# EasyEDA Pro project 干电池充电器.eprj, board PCB4
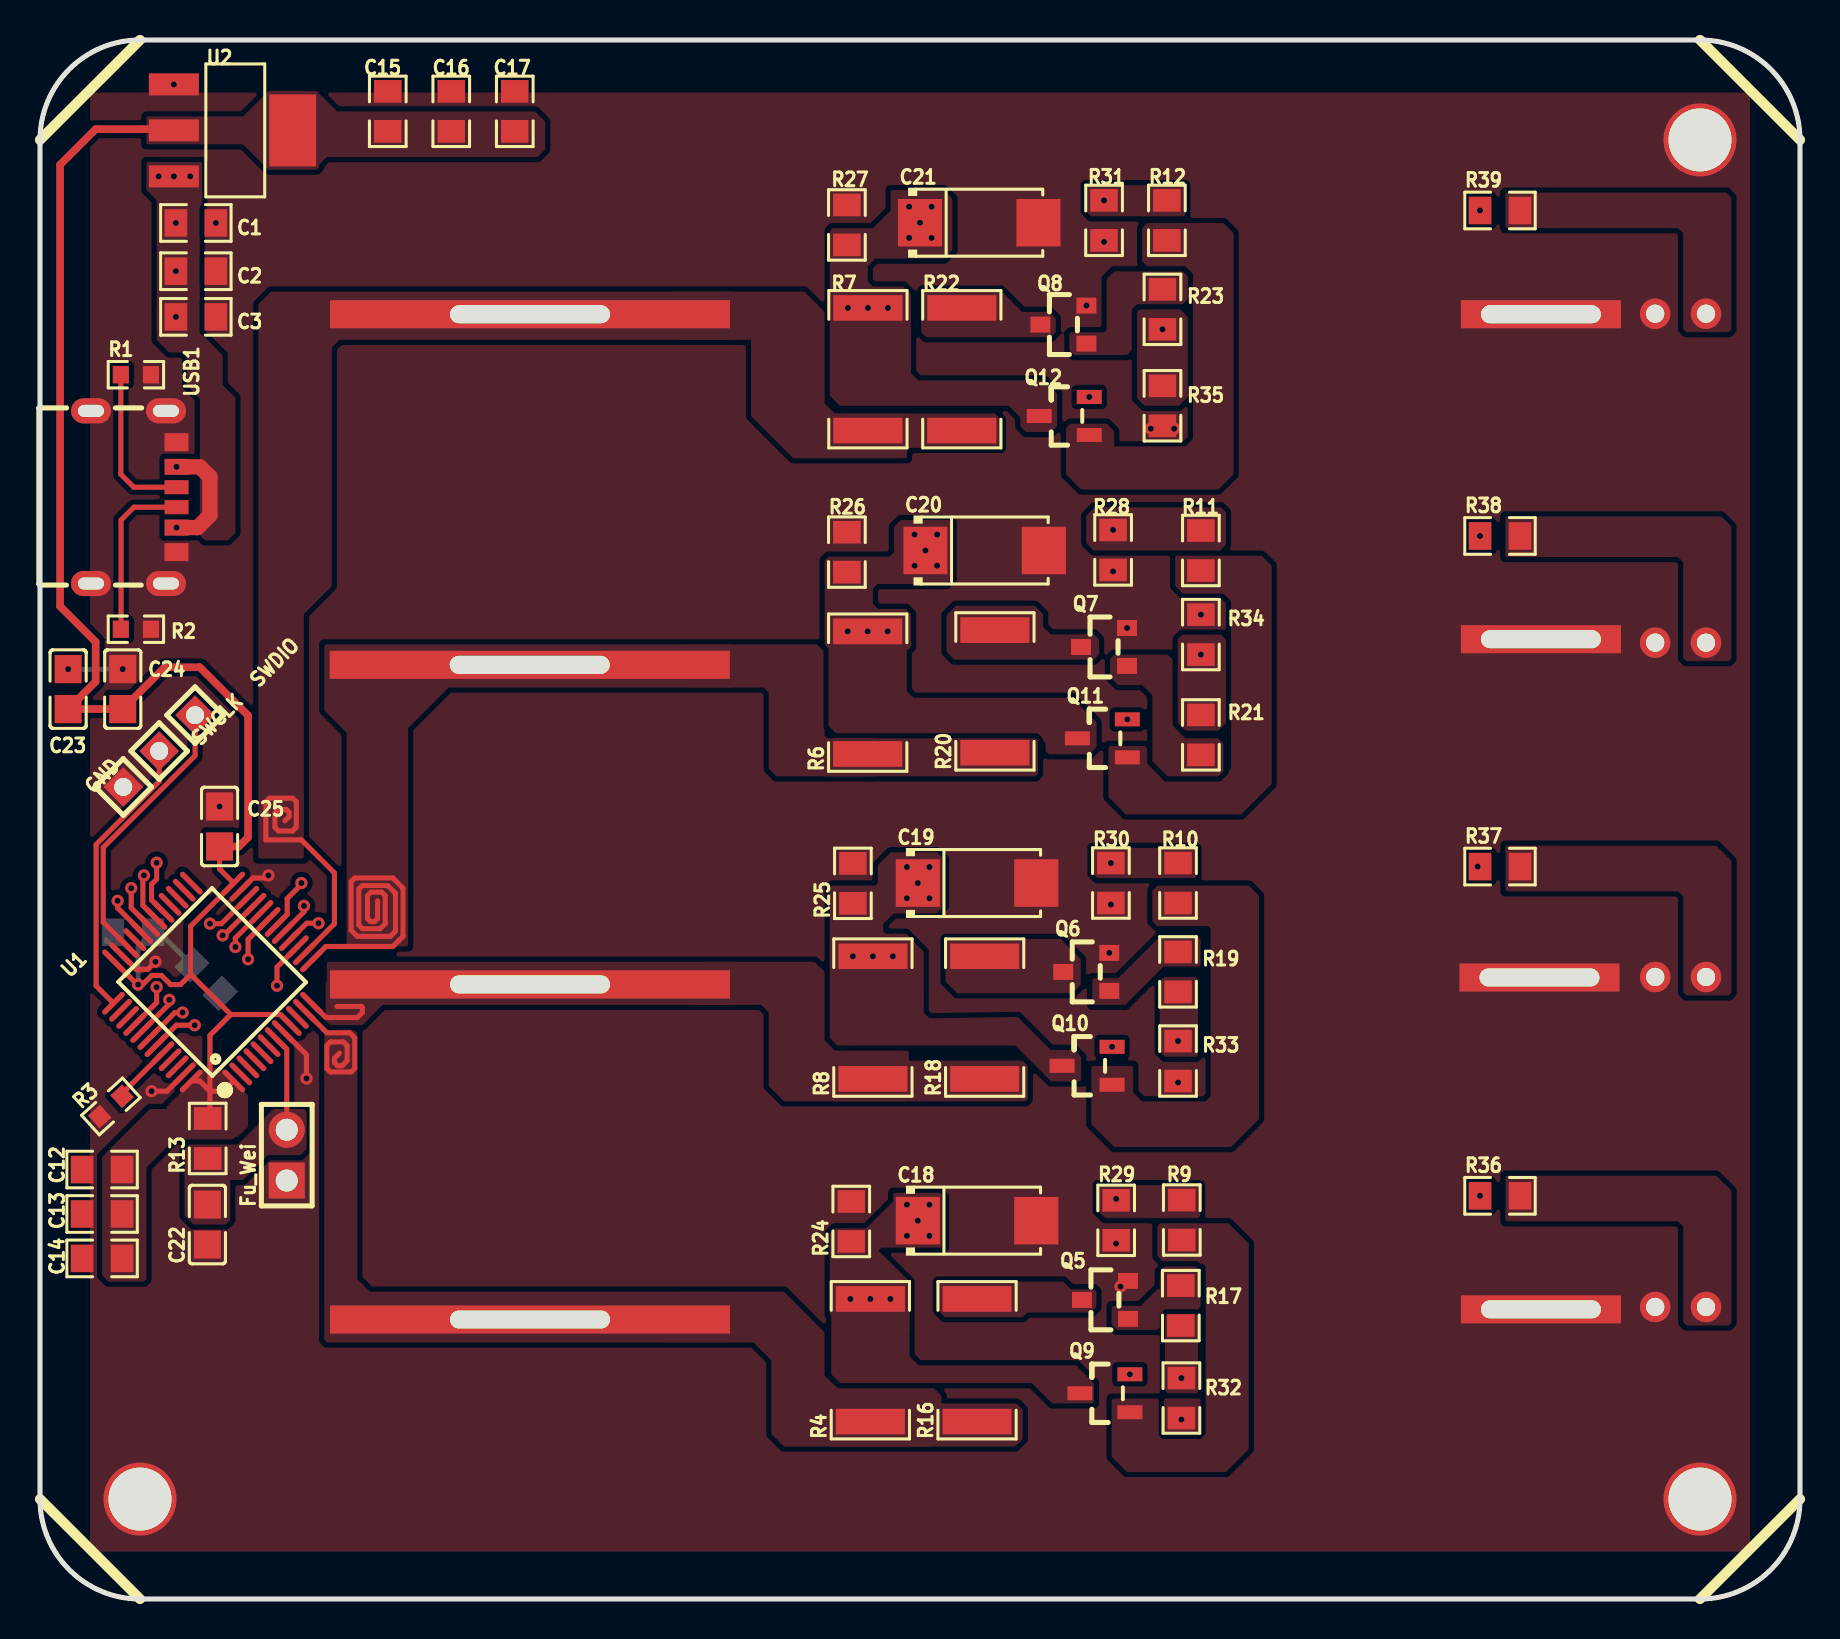
[diagram p3: board, top side]
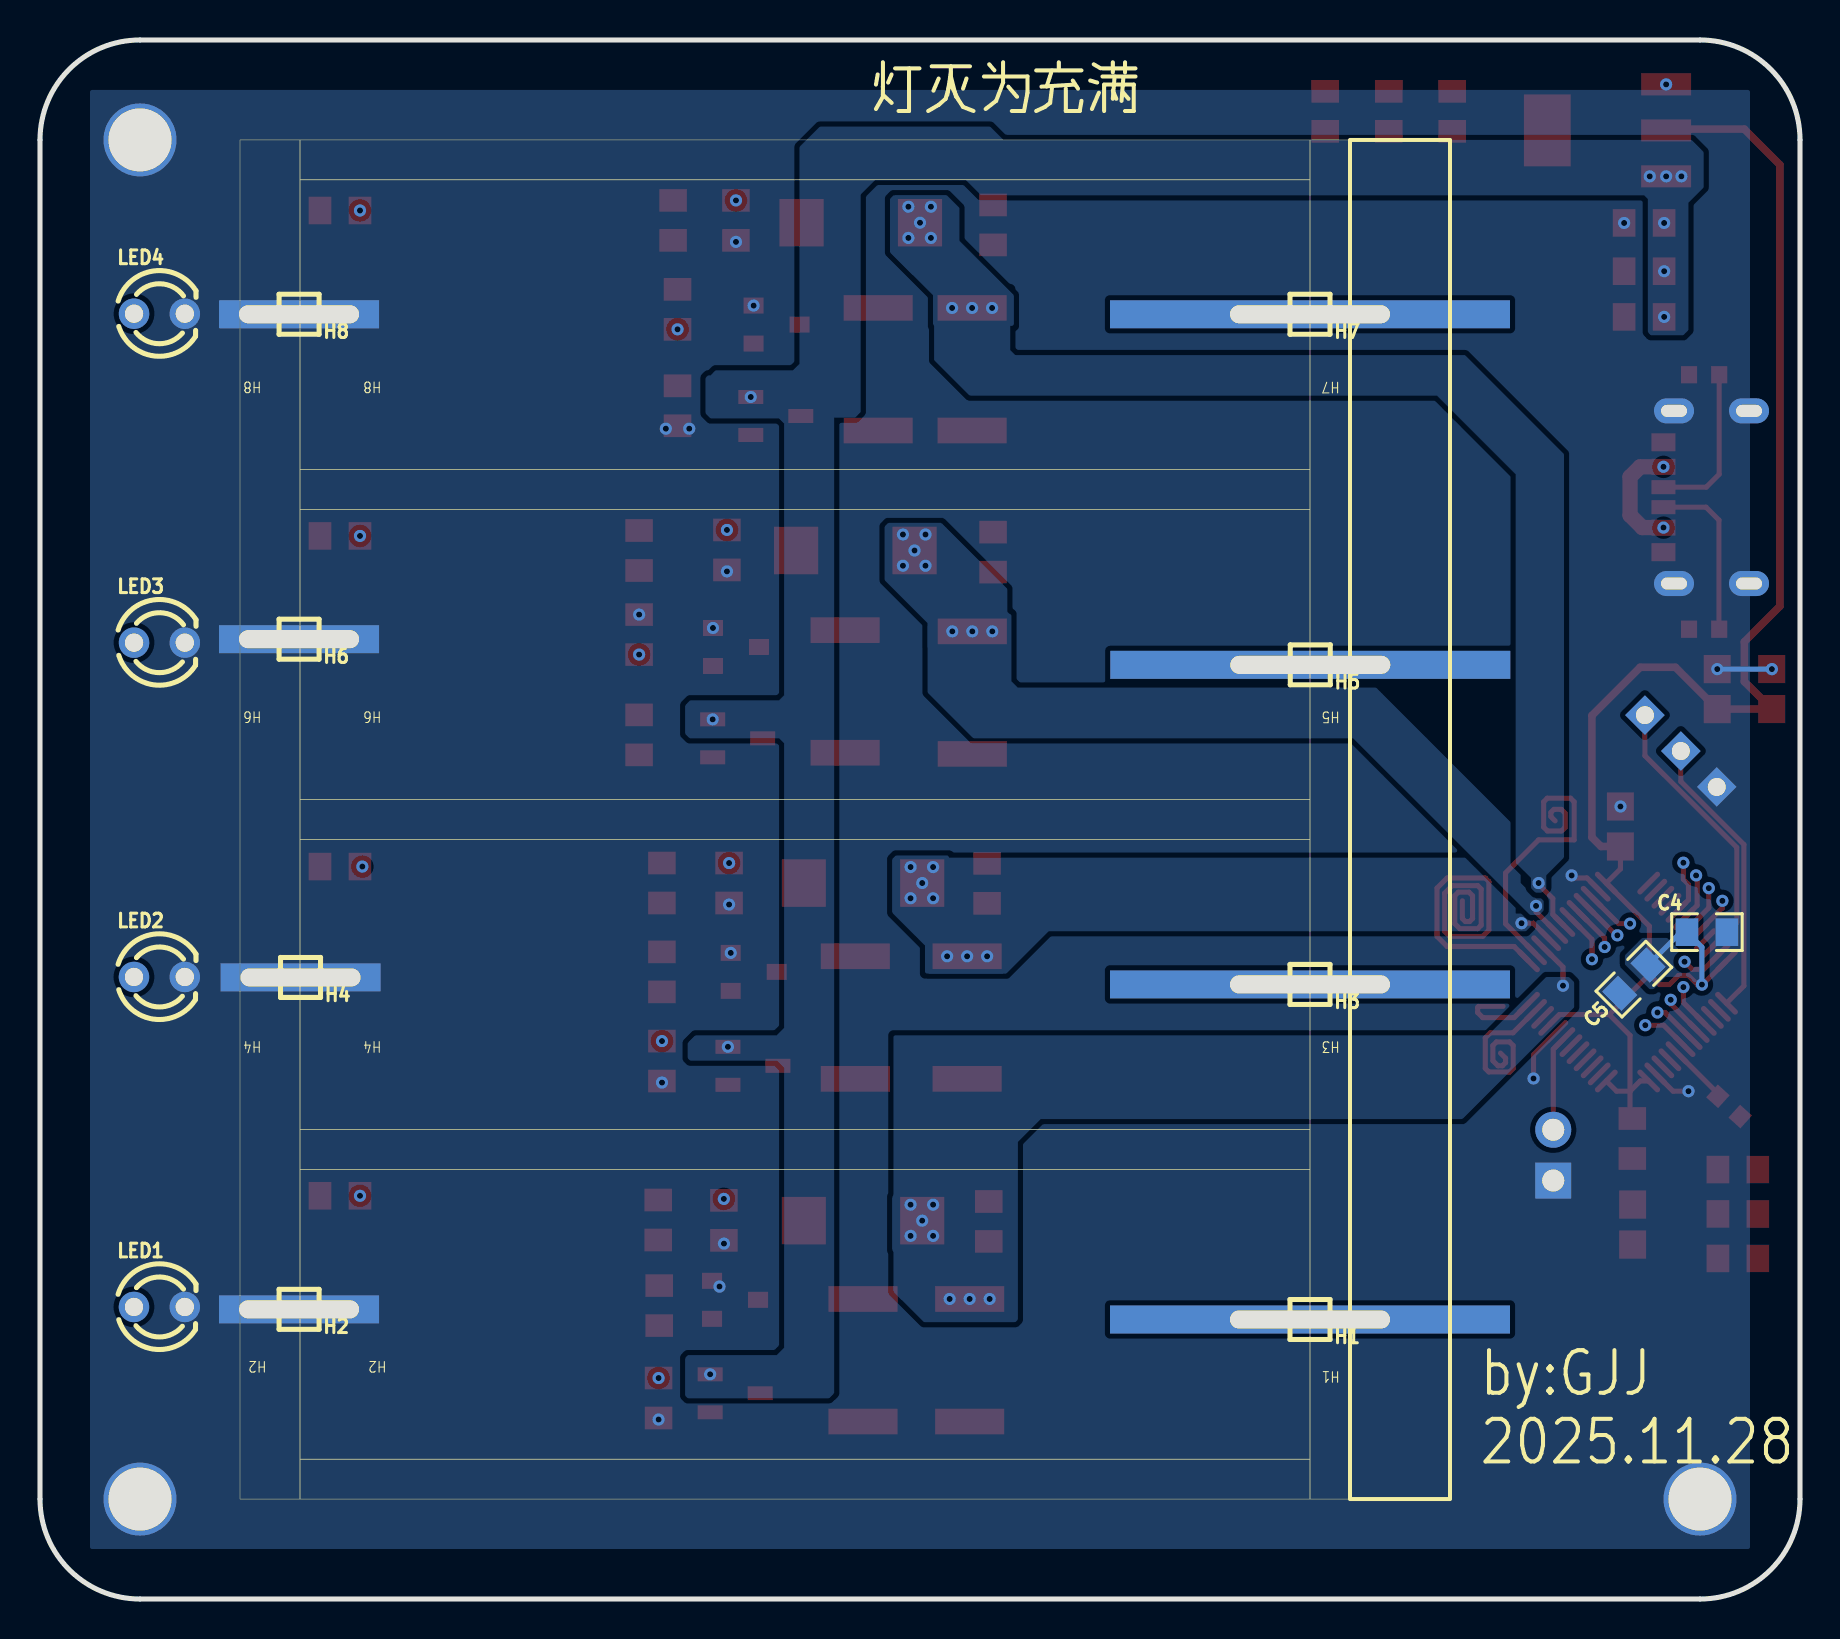
[diagram p4: board, bottom side, seen from below]

Outline 88 x 78 mm; copper layers: Top Layer, Inner1, Inner2, Bottom Layer. Coordinates in mm from the lower left corner of the outline.
Outline path: 0,73 0,5 arc(1.46,1.46) 5,0 83,0 arc(86.54,1.46) 88,5 88,73 arc(86.54,76.54) 83,78 5,78 arc(1.46,76.54) 0,73
Stack: Top Layer 0.035mm 外层铜厚1oz / Dielectric1 0.2104mm 7628 RC49% 8.6mil / Inner1 0.0152mm 内层铜厚 / Dielectric2 1.065mm 1.1mm H/HOZ Copper / Inner2 0.0152mm 内层铜厚 / Dielectric3 0.2104mm 7628 RC49% 8.6mil / Bottom Layer 0.035mm 外层铜厚1oz

## Design rules (mm)
template: 自定义配置
spacing copperThickness1oz (default): track to track 0.102, other pairs 0.152 to 0.3
spacing copperThickness2oz: track to track 0.203, other pairs 0.152 to 0.3
track width copperThickness1oz (default): min 0.127, default 0.254, max 2.54
track width copperThickness2oz: min 0.203, default 0.254, max 2.54
differential pair differentialPair (default): width min 0.127, default 0.254, max 2.54; gap min 0.152, default 0.152
via viaSize (default): diameter min 0.5, default 0.61, max 10; hole min 0.3, default 0.305, max 6.3

## Placement (name value [footprint] x y rotation side)
C1  10uf  [D0805]  7.79 68.84 180 top
C2  1uf  [D0805]  7.79 66.43 180 top
C3  0.1uf  [D0805]  7.79 64.15 180 top
C4  1uf  [D0805]  4.65 33.36 0 bottom
C5  0.1uf  [D0805]  8.3 31.01 135 bottom
C12  10uf  [D0805]  3.11 21.49 180 top
C13  1uf  [D0805]  3.11 19.26 180 top
C14  0.1uf  [D0805]  3.11 17.04 180 top
C15  10uf  [D0805]  17.39 74.43 90 top
C16  1uf  [D0805]  20.56 74.43 90 top
C17  0.1uf  [D0805]  23.74 74.43 90 top
C18  220uF  [CAP-SMD_L6.0-W3.2]  46.85 18.93 0 top
C19  220uF  [CAP-SMD_L6.0-W3.2]  46.85 35.82 0 top
C20  220uF  [CAP-SMD_L6.0-W3.2]  47.23 52.46 0 top
C21  220uF  [CAP-SMD_L6.0-W3.2]  46.96 68.86 0 top
C22  1uf  [C0805]  8.37 18.74 90 top
C23  100nF  [C0805]  1.41 45.52 90 top
C24  1000nF  [C0805]  4.14 45.52 90 top
C25  10000nF  [C0805]  8.98 38.65 90 top
Fu_Wei  -  [HDR-TH_2P-P2.54-V-M-1]  12.34 22.21 90 top
GND  -  [HDR-TH_1P-V-M_XKB_X4611WV-01I-C28D40]  4.16 40.63 225 top
H1  -  [HDR-TH_1P-V-M_XKB_X4611WV-01I-C28D40#2]  24.5 13.98 0 bottom
H2  -  [HDR-TH_1P-V-M_XKB_X4611WV-01I-C28D40#3]  75.05 14.49 0 bottom
H3  -  [HDR-TH_1P-V-M_XKB_X4611WV-01I-C28D40#2]  24.5 30.75 0 bottom
H4  -  [HDR-TH_1P-V-M_XKB_X4611WV-01I-C28D40#3]  74.97 31.1 0 bottom
H5  -  [HDR-TH_1P-V-M_XKB_X4611WV-01I-C28D40#2]  24.49 46.74 0 bottom
H6  -  [HDR-TH_1P-V-M_XKB_X4611WV-01I-C28D40#3]  75.05 48.02 0 bottom
H7  -  [HDR-TH_1P-V-M_XKB_X4611WV-01I-C28D40#2]  24.5 64.28 0 bottom
H8  -  [HDR-TH_1P-V-M_XKB_X4611WV-01I-C28D40#3]  75.05 64.28 0 bottom
LED1  -  [LED_TH-3mm]  82.03 14.61 180 bottom
LED2  -  [LED_TH-3mm]  82.03 31.12 180 bottom
LED3  -  [LED_TH-3mm]  82.03 47.85 180 bottom
LED4  -  [LED_TH-3mm]  82.03 64.3 180 bottom
NOREF  -  [Pad_e1994]  83 73 0 top
NOREF#2  -  [Pad_e1995]  83 5 0 top
NOREF#3  -  [Pad_e1996]  5 5 0 top
Q5  AO3400  [SOT-23_L2.9-W1.3-P1.90-LS2.4-BR]  53.25 14.97 0 top
Q6  AO3400  [SOT-23_L2.9-W1.3-P1.90-LS2.4-BR]  52.31 31.38 0 top
Q7  AO3400  [SOT-23_L2.9-W1.3-P1.90-LS2.4-BR]  53.2 47.63 0 top
Q8  AO3400  [SOT-23_L2.9-W1.3-P1.90-LS2.4-BR]  51.17 63.76 0 top
Q9  -  [S8550P_SOT]  53.2 10.29 0 top
Q10  -  [S8550P_SOT]  52.31 26.68 0 top
Q11  -  [S8550P_SOT]  53.08 43.06 0 top
Q12  -  [S8550P_SOT]  51.17 59.19 0 top
R1  5k1  [R0603]  4.8 61.25 0 top
R2  5K1  [R0603]  4.8 48.52 0 top
R3  5K1  [R0603]  3.55 24.64 222.3 top
R4  100mΩ  [R2512]  41.52 11.94 90 top
R6  100mΩ  [R2512]  41.38 45.35 90 top
R7  100mΩ  [R2512]  41.4 61.53 90 top
R8  100mΩ  [R2512]  41.65 29.09 90 top
R9  200  [R0805]  57.09 18.96 90 top
R10  200  [R0805]  56.9 35.82 90 top
R11  200  [R0805]  58.04 52.46 90 top
R12  200  [R0805]  56.34 68.97 90 top
R13  10K  [R0805]  8.39 23.04 90 top
R16  3Ω  [R2512]  46.85 11.94 90 top
R17  200  [R0805]  57.04 14.68 90 top
R18  3Ω  [R2512]  47.23 29.09 90 top
R19  200  [R0805]  56.9 31.38 90 top
R20  3Ω  [R2512]  47.75 45.41 90 top
R21  200  [R0805]  58.04 43.23 270 top
R22  3Ω  [R2512]  46.09 61.53 90 top
R23  200  [R0805]  56.12 64.52 90 top
R24  47K  [R0805]  40.56 18.89 90 top
R25  47K  [R0805]  40.65 35.8 90 top
R26  47K  [R0805]  40.34 52.38 90 top
R27  47K  [R0805]  40.34 68.75 90 top
R28  47K  [R0805]  53.65 52.49 270 top
R29  47K  [R0805]  53.81 18.95 270 top
R30  47K  [R0805]  53.55 35.82 270 top
R31  47K  [R0805]  53.2 68.97 270 top
R32  47K  [R0805]  57.07 10.06 270 top
R33  47K  [R0805]  56.9 26.91 270 top
R34  47K  [R0805]  58.04 48.25 90 top
R35  47K  [R0805]  56.12 59.7 270 top
R36  1K  [R0805]  73 20.17 0 top
R37  1K  [R0805]  73 36.64 0 top
R38  1K  [R0805]  73 53.19 0 top
R39  1K  [R0805]  73 69.47 0 top
SWCLK  -  [HDR-TH_1P-V-M_XKB_X4611WV-01I-C28D40]  5.96 42.42 225 top
SWDIO  -  [HDR-TH_1P-V-M_XKB_X4611WV-01I-C28D40]  7.75 44.22 225 top
U1  STM32F103C8T6  [LQFP-48_L7.0-W7.0-P0.50-LS9.0-BL]  8.62 30.87 45 top
U2  AMS1117-3.3  [SOT-223-3_L6.5-W3.4-P2.30-LS7.0-BR]  9.66 73.48 180 top
USB1  -  [USB_ TYPE-C-6P]  4.69 55.25 270 top

## Footprints (pads in the part's own frame, mm; a bottom-side part is the same pattern mirrored in y, then rotated)
C0805
  rect 1.41x1.35 smd: 1(-1,0) 2(1,0)
CAP-SMD_L6.0-W3.2
  rect 2.208x2.376 smd: 1(-2.962,0) 2(2.962,0)
D0805
  rect 1.133x1.377 smd: 1(-1,0) 2(1,0)
HDR-TH_1P-V-M_XKB_X4611WV-01I-C28D40
  rect 1.4x1.4 hole 0.9: 1(0,0)
HDR-TH_1P-V-M_XKB_X4611WV-01I-C28D40#2
  rect 20x1.4 hole 8x0.9: 1(0,0)
HDR-TH_1P-V-M_XKB_X4611WV-01I-C28D40#3
  rect 8x1.4 hole 6x0.9: 1(0,0)
HDR-TH_2P-P2.54-V-M-1
  rect 1.8x1.8 hole 1.1: 1(-1.27,0)
  round 1.8 hole 1.1: 2(1.27,0)
LED_TH-3mm
  round 1.524 hole 0.914: 1(-1.27,0) 2(1.27,0)
LQFP-48_L7.0-W7.0-P0.50-LS9.0-BL
  oval 0.27x1.5 smd: 1(-2.75,-4.25) 2(-2.25,-4.25) 3(-1.75,-4.25) 4(-1.25,-4.25) 5(-0.75,-4.25) 6(-0.25,-4.25) 7(0.25,-4.25) 8(0.75,-4.25) 9(1.25,-4.25) 10(1.75,-4.25) 11(2.25,-4.25) 12(2.75,-4.25) 25(2.75,4.25) 26(2.25,4.25) 27(1.75,4.25) 28(1.25,4.25) 29(0.75,4.25) 30(0.25,4.25) 31(-0.25,4.25) 32(-0.75,4.25) 33(-1.25,4.25) 34(-1.75,4.25) 35(-2.25,4.25) 36(-2.75,4.25)
  oval 1.5x0.27 smd: 13(4.25,-2.75) 14(4.25,-2.25) 15(4.25,-1.75) 16(4.25,-1.25) 17(4.25,-0.75) 18(4.25,-0.25) 19(4.25,0.25) 20(4.25,0.75) 21(4.25,1.25) 22(4.25,1.75) 23(4.25,2.25) 24(4.25,2.75) 37(-4.25,2.75) 38(-4.25,2.25) 39(-4.25,1.75) 40(-4.25,1.25) 41(-4.25,0.75) 42(-4.25,0.25) 43(-4.25,-0.25) 44(-4.25,-0.75) 45(-4.25,-1.25) 46(-4.25,-1.75) 47(-4.25,-2.25) 48(-4.25,-2.75)
Pad_e1994
  round 3.65 hole 3.15: 1(0,0)
Pad_e1995
  round 3.65 hole 3.15: 1(0,0)
Pad_e1996
  round 3.65 hole 3.15: 1(0,0)
R0603
  rect 0.806x0.864 smd: 1(-0.753,0) 2(0.753,0)
R0805
  rect 1.133x1.377 smd: 1(-1,0) 2(1,0)
R2512
  rect 1.282x3.456 smd: 1(-3.067,0) 2(3.067,0)
S8550P_SOT
  rect 1.25x0.701 smd: 1(1.292,-0.95) 2(1.292,0.95) 3(-1.208,0)
SOT-23_L2.9-W1.3-P1.90-LS2.4-BR
  rect 1x0.8 smd: 1(1.15,-0.95) 2(1.15,0.95) 3(-1.15,0)
SOT-223-3_L6.5-W3.4-P2.30-LS7.0-BR
  rect 2.5x1.1 smd: 1(2.97,-2.3) 2(2.97,0) 3(2.97,2.3)
  rect 2.34x3.6 smd: 4(-2.97,0)
USB_ TYPE-C-6P
  oval 1.25x2 hole 0.6x1.3: 7(-4.193,1.611) 8(4.447,1.611) 9(-4.193,-2.139) 10(4.447,-2.139)
  rect 0.7x1.2 smd: A5(-0.373,2.139) B5(0.627,2.139)
  rect 0.8x1.2 smd: A9(1.647,2.139) B9(-1.393,2.139)
  rect 0.9x1.2 smd: A12(2.877,2.139) B12(-2.623,2.139)

## Nets
As in the schematic, except:
GND: C1.1 C2.1 C3.1 C4.1 C5.1 C12.2 C13.2 C14.2 C15.2 C16.2 C17.2 C18.2 C19.2 C20.2 C21.2 C22.1 C23.2 C24.2 C25.2 Fu_Wei.1 GND.1 H2.1 H4.1 H6.1 H8.1 LED1.2 LED2.2 LED3.2 LED4.2 NOREF.1 NOREF#2.1 NOREF#3.1 Q5.2 Q6.2 Q7.2 Q8.2 R1.2 R2.2 R3.2 R24.2 R25.2 R26.2 R27.2 R28.2 R29.2 R30.2 R31.2 R32.2 R33.2 R34.2 R35.2 U1.8 U1.23 U1.35 U1.47 U2.1 USB1.7 USB1.8 USB1.9 USB1.10 USB1.A12 USB1.B12

Pads without a net: U1 2 3 4 5 6 10 25 26 27 28 33 38 39 45 46

## Via types
v1: diameter 0.61, hole 0.305, Top Layer to Bottom Layer, 95 vias

## Routing (per net, layer and track width the routed paths; a pad name or vN(x,y) marks a point on that pad's centre or on a via; arc(x,y) is an arc through that point)
+5V: length 5.7
  Top Layer w0.762: v1(6.83,56.64) 7.99,56.64 8.5,56.14 8.5,54.22 7.88,53.6 v1(6.83,53.6)
  vias: v1(5.93,71.18) v1(6.69,71.18) v1(6.79,68.84) v1(6.79,66.43) v1(6.79,64.15) v1(7.51,71.18) v1(52.46,60.14) v1(53.6,27.63) v1(54.37,44.01) v1(54.49,11.24)
GND: length 11.5
  Top Layer w0.254: U1.35 4.81,31.5 5.39,31.5 v1(5.77,31.88) ; 12.16,28.39 13.32,27.23 v1(13.32,26.04) ; v1(11.42,36.2) 11.29,36.07 10.65,36.07 U1.23 ; v1(5.58,25.41) 6.35,25.41 U1.47
  Bottom Layer w0.254: v1(1.41,46.52) v1(4.14,46.52)
  vias: v1(6.69,75.78) v1(8.79,68.84) v1(8.98,39.65) v1(52.32,64.71) v1(53.2,67.9) v1(53.46,32.33) v1(53.55,34.75) v1(53.65,51.41) v1(53.8,17.78) v1(54.03,15.63) v1(54.35,48.58) v1(55.54,58.55) v1(56.71,58.55) v1(56.9,25.84) v1(57.07,8.98) v1(58.04,49.25)
VCC: length 85.9
  Top Layer w0.254: R13.2 8.5,24.15 8.5,25.41 ; 8.5,25.41 7.99,25.92 U1.48 ; 8.5,25.41 8.5,28.2 9.54,29.24 ; 8.5,25.41 9.17,25.41 U1.1 ; 9.54,29.24 12.03,29.24 12.51,28.76 12.51,28.75 ; 9.54,29.24 7.53,31.25 ; 7.53,31.25 7.53,33.66 U1.24 8.98,36.52 C25.1 ; 7.53,31.25 7.02,30.74 6.53,30.74 6.07,31.2 5.59,31.2 5.13,30.74 v1(4.91,30.74) 4.86,30.74 U1.36
  Top Layer w0.381: C25.1 9.95,37.65 10.4,38.11 10.4,44.2 7.99,46.62 6.23,46.62 C24.1 C23.1 2.78,45.9 2.78,47.89 1.01,49.66 1.01,71.76 2.78,73.54 6.63,73.54 U2.2
  Bottom Layer w0.254: C5.2 5.95,33.36 C4.2 4.91,32.62 v1(4.91,30.74)
ADC_1: length 10.6
  Top Layer w0.254: 14.98,27.31 14.72,27.06 14.72,26.83 14.88,26.68 15.1,26.68 15.36,26.93 15.36,27.69 15.18,27.87 14.52,27.87 14.34,27.69 14.34,26.55 14.52,26.37 15.56,26.37 15.74,26.55 15.74,28.07 15.48,28.33 14.35,28.33 U1.11
ADC_2: length 4.5
  Top Layer w0.254: 14.85,29.65 16.07,29.65 16.12,29.6 16.12,29.34 15.86,29.09 14.29,29.09 U1.12
ADC_3: length 27.6
  Top Layer w0.254: U1.13 14.29,32.65 17.64,32.65 18.15,33.15 18.15,35.57 17.64,36.07 15.74,36.07 15.56,35.9 15.56,33.46 15.86,33.15 17.52,33.15 17.77,33.41 17.77,35.31 17.39,35.69 16.12,35.69 15.94,35.51 15.94,33.71 16.12,33.53 17.01,33.53 17.26,33.79 17.26,35.19 17.08,35.37 16.55,35.37 16.37,35.19 16.37,34.04 16.52,33.89 16.73,33.89 16.88,34.04 16.88,34.93
ADC_4: length 16.9
  Top Layer w0.254: 12.24,38.93 12.46,39.14 12.46,39.35 12.31,39.5 11.93,39.5 11.75,39.32 11.75,38.6 11.93,38.42 12.63,38.42 12.82,38.61 12.82,39.88 12.64,40.06 11.47,40.06 11.29,39.88 11.29,37.98 13.07,37.98 14.72,36.33 14.72,33.78 U1.14
ADC_CU_1: length 2.4
  Top Layer w0.254: U1.15 11.85,31.62 v1(11.85,30.69)
  vias: v1(40.52,15.01) v1(41.52,15.01) v1(42.52,15.01) v1(43.35,19.73) v1(43.35,18.17) v1(43.89,18.93) v1(44.47,19.73) v1(44.47,18.17)
ADC_CU_2: length 1.7
  Top Layer w0.254: 12.51,32.99 13.34,33.81 v1(13.92,33.81)
  vias: v1(40.65,32.16) v1(41.65,32.16) v1(42.65,32.16) v1(43.35,36.62) v1(43.35,35.06) v1(43.89,35.82) v1(44.47,36.62) v1(44.47,35.06)
ADC_CU_3: length 1.8
  Top Layer w0.254: v1(13.2,34.68) 13.2,34.38 12.16,33.34
  vias: v1(40.38,48.41) v1(41.38,48.41) v1(42.38,48.41) v1(43.73,53.26) v1(43.73,51.7) v1(44.27,52.46) v1(44.85,53.26) v1(44.85,51.7)
ADC_CU_4: length 2.6
  Top Layer w0.254: v1(13.07,35.82) 13.07,35.76 12.36,35.05 12.36,34.25 U1.18
  vias: v1(40.4,64.59) v1(41.4,64.59) v1(42.4,64.59) v1(43.46,69.66) v1(43.46,68.1) v1(44,68.86) v1(44.58,69.66) v1(44.58,68.1)
CHG_SW1: length 58.1
  Top Layer w0.254: v1(5.83,36.84) 5.83,36.01 5.58,35.76 5.58,34.98 6.15,34.4
  Inner2 w0.254: v1(53.81,20.02) 51.96,20.02 34.73,37.24 6.24,37.24 v1(5.83,36.84)
CHG_SW2: length 52.2
  Top Layer w0.254: v1(5.2,36.2) 5.14,36.15 5.14,34.7 U1.30
  Inner2 w0.254: v1(5.2,36.2) 5.25,36.25 5.25,37.08 5.77,37.6 52.77,37.6 v1(53.55,36.82)
CHG_SW3: length 59.5
  Top Layer w0.254: U1.31 4.56,34.58 v1(4.56,35.57)
  Inner2 w0.254: v1(53.65,53.49) 50.29,53.49 34.76,37.95 5.62,37.95 4.61,36.95 4.61,35.62 v1(4.56,35.57)
CHG_SW4: length 74.6
  Top Layer w0.254: 5.09,33.34 5.09,33.36 3.88,34.57 v1(3.88,34.93)
  Inner2 w0.254: v1(3.88,34.93) 3.98,35.03 3.98,36.82 5.47,38.31 34.61,38.31 50.03,53.72 50.03,66.8 v1(53.2,69.97)
DIS_CHG_SW1: length 59.2
  Top Layer w0.254: U1.19 10.4,33 v1(10.4,32.01)
  Inner1 w0.254: v1(57.07,11.06) 57.07,13.41 38.47,32.01 v1(10.4,32.01)
DIS_CHG_SW2: length 52.1
  Top Layer w0.254: 11.1,34.4 9.77,33.07 v1(9.77,32.62)
  Inner1 w0.254: v1(9.77,32.62) 9.79,32.59 10.64,32.59 10.87,32.37 38.62,32.37 43.95,27.04 56.03,27.04 v1(56.9,27.91)
DIS_CHG_SW3: length 57.4
  Top Layer w0.254: v1(9.13,33.2) 9.19,33.2 10.75,34.76
  Inner1 w0.254: v1(58.04,47.25) 53.15,47.25 38.62,32.72 11.02,32.72 10.79,32.95 10.28,32.95 10.02,33.2 v1(9.13,33.2)
DIS_CHG_SW4: length 72.1
  Top Layer w0.254: U1.22 9.07,33.79 v1(8.5,33.79)
  Inner1 w0.254: v1(56.12,63.52) 56.12,47.89 55.84,47.61 53,47.61 38.47,33.08 11.17,33.08 10.94,33.31 10.49,33.31 10.24,33.56 9.64,33.56 9.41,33.79 v1(8.5,33.79)
LED1: length 75.6
  Top Layer w0.254: 4.74,28.75 5.83,29.84 v1(5.83,30.61)
  Inner2 w0.254: v1(5.83,30.61) 5.83,28.78 7.23,27.39 8.25,27.39 8.5,27.64 42.32,27.64 51.59,18.37 54.61,18.37 56.41,20.17 v1(72,20.17)
LED2: length 80.9
  Top Layer w0.254: v1(6.47,29.98) 6.47,29.77 5.09,28.39
  Inner2 w0.254: v1(71.88,36.64) 65.6,30.36 65.6,29.86 54.46,18.72 51.74,18.72 42.47,28 8.35,28 8.1,27.74 7.37,27.74 6.54,28.57 6.54,29.9 v1(6.47,29.98)
LED3: length 95.8
  Top Layer w0.254: U1.42 6.75,29.34 v1(7.13,29.34)
  Inner2 w0.254: v1(7.13,29.34) 7.13,28.49 7.49,28.12 7.98,28.12 8.21,28.35 42.62,28.35 51.89,19.08 54.31,19.08 65.24,30.01 65.24,46.43 v1(72,53.19)
LED4: length 110.1
  Top Layer w0.254: v1(7.74,28.71) 6.82,28.71 U1.43
  Inner2 w0.254: v1(7.74,28.71) 42.76,28.71 52.04,19.43 54.16,19.43 64.89,30.16 64.89,62.35 v1(72,69.47)
RESET: length 4.8
  Top Layer w0.254: Fu_Wei.2 12.34,27.51 U1.7
$1N759: length 8
  Top Layer w0.254: R1.1 4.04,56.27 4.69,55.62 6.83,55.62
$1N785: length 8.5
  Top Layer w0.254: R2.1 4.05,48.53 4.05,53.98 4.7,54.62 6.83,54.62
$1N1881: length 3
  Top Layer w0.254: R3.1 4.1,25.28 6.15,27.33
$1N2574: length 14
  Top Layer w0.254: U1.34 3.16,33.86 3.16,37.6 7.75,42.19 SWDIO.1
$1N2624: length 14.3
  Top Layer w0.254: U1.37 2.81,30.68 2.81,37.75 5.96,40.9 SWCLK.1

## Copper pours and planes (outline as drawn; the poured copper is in the pictures)
+5V on Top Layer: 5.83,64.65 5.83,63 6.47,62.36 7.23,62.36 7.36,62.24 7.36,60.71 7.99,60.08 7.99,53.22 8.24,52.97 9.39,52.97 9.77,53.35 9.77,60.1 9.15,60.71 9.13,60.71 9.13,62.26 9.11,62.26 7.96,63.41 7.96,64.81 7.36,65.41 6.09,65.41 5.96,65.28 5.96,64.78
+5V on Top Layer: 5.32,70.75 5.32,70.49 6.21,69.6 6.21,70.49 5.7,71 5.58,71
+5V on Top Layer: 5.32,71.89 8.12,71.89 8.12,69.73 7.99,69.6 7.99,63.38 7.86,63.25 5.96,63.25 5.83,63.38 5.83,70.24 5.58,70.49 5.32,70.49
+5V on Bottom Layer: 5.83,63.23 7.46,63.23 7.61,63.38 7.61,70.04 7.79,70.23 40.95,70.23 41.72,71 46.23,71 46.96,70.27 46.96,59.39 47.25,59.1 54.47,59.1 54.47,61.22 54.22,61.47 50.35,61.47 50.03,61.8 50.03,72.65 49.01,73.67 40.49,73.67 39.83,73 5.42,73 4.81,72.4 4.81,70.62 5.58,69.86 5.58,63.49
+5V on Bottom Layer: 55.74,12.07 55.74,10.17 55.62,10.04 48.55,10.04 48.29,10.29 48.29,60.88 48.63,61.22 54.6,61.22 54.73,61.09 54.73,59.32 54.47,59.06 51.04,59.06 50.79,58.81 50.79,45.22 51.04,44.96 55.49,44.96 55.74,44.71 55.74,43.28 55.52,43.06 51.04,43.06 50.79,42.81 50.79,28.58 51.17,28.2 55.23,28.2 55.62,27.82 55.62,27.06 55.49,26.93 51.16,26.93 50.79,26.56 50.79,12.58 51.17,12.2 55.62,12.2
GND on Top Layer: 2.5,75.37 2.5,2.37 85.5,2.37 85.5,75.37
GND on Bottom Layer: 2.5,75.5 2.5,2.5 85.5,2.5 85.5,75.5
GND on Inner1: 2.5,75.5 85.5,75.5 85.5,2.5 2.5,2.5
GND on Inner2: 2.5,75.5 85.5,75.5 85.5,2.5 2.5,2.5
VCC on Top Layer: 5.32,74.17 5.32,72.78 10.15,72.78 11.42,71.51 13.83,71.51 13.96,71.63 13.96,75.32 13.83,75.44 11.42,75.44 10.15,74.17
VCC on Top Layer: 24.75,74.43 25.26,73.92 25.26,72.52 24.88,72.14 14.34,72.14 13.83,71.63 11.42,71.63 11.42,75.37 13.76,75.37 13.83,75.44 14.85,74.43
VCC on Top Layer: 3.11,16.19 3.42,15.88 5.2,15.88 5.32,16.01 5.32,21.6 6.72,22.99 9.64,22.99 10.28,23.63 10.28,24.77 9.89,25.15 6.97,25.15 6.34,24.52 5.5,24.52 3.11,22.12
VCC on Top Layer: 7.56,25.92 8.22,26.57 9.02,26.57 9.67,25.92 9.69,25.92 10.4,25.2 10.4,23.63 9.89,23.12 6.72,23.12 6.34,23.5 6.34,24.64 7.56,25.87
VCC on Bottom Layer: 5.2,31.63 4.94,31.63 4.81,31.5 4.81,30.93 4.9,30.85 5.43,30.85 5.7,31.12 6.71,31.12 7.32,30.51 7.52,30.51 8.76,31.75 8.76,32.21 7.89,33.07 6.64,33.07
ADC_1 on Top Layer: 37.2,15.37 39.23,13.34 39.23,11.18 39.74,10.67 44.57,10.67 45.07,10.17 45.07,8.13 44.57,7.63 37.2,7.63 36.56,8.26 36.56,11.94 35.68,12.83 31.2,12.83 31.2,14.84 31.74,15.37
ADC_1 on Top Layer: 14.21,28.42 14.35,28.56 15.63,28.56 15.86,28.33 15.86,16.01 16.5,15.37 34.15,15.37 34.79,14.74 34.79,13.22 34.41,12.83 14.34,12.83 14.21,12.96
ADC_1 on Top Layer: 39.49,7.75 39.49,9.41 39.87,9.79 48.82,9.79 49.14,9.47 49.14,8.01 48.76,7.63 39.61,7.63
ADC_2 on Top Layer: 39.61,26.93 49.14,26.93 49.39,26.68 49.39,25.03 49.27,24.9 39.61,24.9 39.49,25.03 39.49,26.72
ADC_2 on Top Layer: 33.52,31.88 38.72,31.88 39.23,31.38 39.23,27.95 39.74,27.44 43.45,27.44 43.45,25.05 43.3,24.9 37.2,24.9 36.44,25.66 36.44,29.34 36.06,29.72 32.45,29.72 32.45,30.82
ADC_2 on Top Layer: 14.29,30.85 14.29,28.89 14.47,28.71 16.12,28.71 17.13,29.72 34.53,29.72 34.91,30.11 34.91,31.5 34.53,31.88 14.34,31.88 14.34,30.9
ADC_3 on Top Layer: 14.21,47.76 34.66,47.76 34.79,47.63 34.79,45.85 34.53,45.6 20.44,45.6 18.4,43.57 18.4,32.65 15.33,32.65 15.33,43.34 14.21,44.46
ADC_3 on Top Layer: 39.36,43.06 49.77,43.06 49.9,42.93 49.9,41.28 49.77,41.15 39.23,41.15 39.1,41.28 39.1,42.81
ADC_3 on Top Layer: 31.87,47.76 38.85,47.76 39.23,47.38 39.23,43.19 39.36,43.06 41.77,43.06 41.9,42.93 41.9,41.28 41.77,41.15 36.82,41.15 36.44,41.54 36.44,45.35 36.18,45.6 32.37,45.6 31.99,45.98 31.99,47.63
ADC_4 on Top Layer: 39.44,57.59 48.05,57.59 48.05,59.01 47.74,59.32 39.68,59.32 39.44,59.07
ADC_4 on Top Layer: 43.35,59.32 43.35,57.07 37.66,57.07 35.55,59.19 35.55,63 31.99,63 31.49,63.51 31.49,65.28 31.61,65.41 38.22,65.41 39.23,64.4 39.23,59.82 39.74,59.32
ADC_4 on Top Layer: 34.66,65.41 34.91,65.16 34.91,63.38 34.53,63 14.98,63 14.59,62.62 14.59,50.68 13.2,49.28 13.2,37.05 10.91,37.05 10.91,64.78 11.55,65.41
ADC_CU_1 on Top Layer: 39.61,13.34 39.61,16.98 42.38,16.98 43.47,15.88 43.47,13.39 43.42,13.34
ADC_CU_1 on Top Layer: 52.69,10.8 52.69,9.79 50.61,9.79 49.6,10.8 40,10.8 39.56,11.25 39.56,14.45 43.47,14.45 43.47,12.15 43.93,11.69 51.81,11.69
ADC_CU_1 on Top Layer: 39.74,18.55 41.39,18.55 41.39,17.96 43.47,15.88 43.47,14.2 39.49,14.2 39.49,18.29
ADC_CU_1 on Top Layer: 41.2,18.44 42.66,19.9 42.66,20.33 44.98,20.33 45.2,20.11 45.2,17.58 42.07,17.58 41.65,17.15 39.65,17.15 39.65,18.41 39.67,18.44
ADC_CU_1 on Bottom Layer: 11.55,31.12 12.69,31.12 15.61,28.2 45.33,28.2 45.33,15.37 43.8,13.85 39.23,13.85 39.1,13.98 39.1,22.87 37.96,24.01 16.88,24.01 11.29,29.6 11.29,30.87
ADC_CU_1 on Bottom Layer: 42.55,20.31 45.21,20.31 45.39,20.13 45.39,17.44 43.75,15.81 43.75,13.9 39.38,13.9 39.38,16.25 42.55,16.25
ADC_CU_2 on Top Layer: 50.53,27.48 51.7,27.48 52.06,27.12 52.06,25.89 50.56,25.89 48.76,27.69 39.87,27.69 39.49,28.07 39.49,33.03 39.74,33.28 43.3,33.28 44.19,32.39 44.19,29.34 44.48,29.05 48.88,29.12
ADC_CU_2 on Top Layer: 42.54,37.37 44.85,37.37 45.2,37.02 45.2,34.67 44.82,34.3 42.68,34.3 42.15,33.77 42.15,33.41 42.28,33.28 43.3,33.28 43.68,32.9 43.68,31.63 43.3,31.25 39.87,31.25 39.49,31.63 39.49,35.57 39.61,35.69 41.78,35.69 41.89,35.8 41.89,36.71
ADC_CU_2 on Bottom Layer: 13.7,34.3 13.45,34.04 13.45,33.66 13.7,33.41 37.57,33.41 39.69,31.29 43.59,31.29 43.68,31.38 43.68,32.75 45.33,34.4 45.33,36.96 45.2,37.09 16.63,37.09 14.21,34.68 14.21,34.3
ADC_CU_2 on Bottom Layer: 42.55,37.2 45.21,37.2 45.39,37.02 45.39,34.34 43.75,32.7 43.75,31.29 39.76,31.29 39.76,33.14 42.55,33.14
ADC_CU_3 on Top Layer: 43.34,49.28 43.34,45.43 43.68,45.09 51.6,45.09 52.83,43.86 52.83,42.62 52.47,42.26 50.45,42.26 50.28,42.42 50.28,42.81 49.77,43.31 39.79,43.31 39.43,43.67 39.43,49.22 39.49,49.28
ADC_CU_3 on Top Layer: 39.43,52.15 42.47,52.15 42.7,52.38 42.7,53.64 43.04,53.98 45.46,53.98 45.58,53.85 45.58,51.04 45.33,50.78 41.87,50.78 41.65,50.55 41.65,49.79 41.9,49.54 43.3,49.54 43.55,49.28 43.55,47.63 43.42,47.5 39.49,47.5 39.23,47.76 39.23,51.95
ADC_CU_3 on Bottom Layer: 42.93,53.84 45.59,53.84 45.77,53.66 45.77,50.97 43.62,48.83 43.62,47.55 39.45,47.55 39.45,49.22 39.63,49.39 39.63,50.54
ADC_CU_3 on Bottom Layer: 12.94,35.06 12.82,34.93 12.82,34.44 13.04,34.22 13.5,34.22 22.34,43.06 41.33,43.06 43.62,45.35 43.62,48.69 43.03,49.28 39.43,49.28 39.43,45.92 39.1,45.6 21.2,45.6 13.96,38.36 13.96,35.82 13.2,35.06
ADC_CU_4 on Top Layer: 42.53,70.49 45.19,70.49 45.62,70.06 45.62,67.48 45.2,67.06 41.77,67.06 41.39,66.68 41.39,65.92 41.65,65.67 43.17,65.67 43.55,65.28 43.55,61.35 43.93,60.97 50.21,60.97 50.86,60.32 50.86,58.69 50.56,58.39 49.3,58.39 49.01,58.68 49.01,59.13 48.44,59.7 39.99,59.7 39.49,60.2 39.49,68.46 39.61,68.59 41.65,68.59 42.53,69.48
ADC_CU_4 on Bottom Layer: 42.66,70.24 45.32,70.24 45.5,70.06 45.5,67.37 43.35,65.23 43.35,63.7 39.31,63.7 39.31,65.23 42.03,67.95 42.03,69.6
ADC_CU_4 on Bottom Layer: 12.69,35.57 12.91,35.34 13.23,35.34 13.45,35.57 13.45,36.07 14.21,36.84 14.21,56.27 18.15,60.2 41.52,60.2 43.3,61.98 43.3,65.28 43.17,65.41 39.61,65.41 39.49,65.54 39.49,62.49 39.23,62.24 16.75,62.24 11.8,57.28 11.8,37.09 12.69,36.2 12.69,36.2
CHG_SW1 on Top Layer: 52.89,20.71 58.01,20.71 58.01,19.16 57.9,19.06 53.26,19.06 52.89,19.42
CHG_SW2 on Top Layer: 52.63,37.58 57.82,37.58 57.82,36.07 52.86,36.07 52.63,36.3
CHG_SW3 on Top Layer: 52.74,54.62 59.04,54.62 59.3,54.37 59.3,52.75 59,52.46 52.69,52.46 52.31,52.84 52.31,54.2
CHG_SW4 on Top Layer: 52.28,70.73 57.25,70.73 57.27,70.75 57.27,69.18 52.56,69.18 52.28,69.45
DIS_CHG_SW1 on Top Layer: 56.25,14.36 57.9,14.36 57.9,10.29 56.38,10.29 56.25,10.42
DIS_CHG_SW2 on Top Layer: 55.98,30.9 56.21,31.12 57.77,31.12 57.9,30.99 57.9,27.21 57.82,27.13 56.25,27.13 55.98,27.39
DIS_CHG_SW3 on Top Layer: 57.13,48.25 59.05,48.25 59.28,48.01 59.3,48.01 59.3,43.82 58.92,43.44 57.27,43.44 56.88,43.82 56.88,48.01
DIS_CHG_SW4 on Top Layer: 54.98,64.52 57.01,64.52 57.39,64.14 57.39,60.14 56.95,59.7 55.23,59.7 54.85,60.08 54.85,64.4
RESET on Top Layer: 7.48,22.74 9.89,22.74 11.67,24.52 13.2,24.52 13.32,24.39 13.32,22.52 13.01,22.21 11.39,22.21 10.14,20.96 9.51,20.96 9.51,18.96 9.29,18.74 7.68,18.74 7.23,19.18 7.23,22.49
$1N2965 on Top Layer: 53.58,10.03 55.94,10.03 55.94,8.19 56.12,8.01 58.03,8.01 58.28,8.26 58.28,16.64 58.16,16.77 56.25,16.77 55.87,17.15 55.87,18.68 56,18.8 59.43,18.8 60.44,17.79 60.44,7.5 59.3,6.36 54.34,6.36 53.58,7.12
$1N2970 on Top Layer: 54.66,26.68 54.66,25.34 55.11,24.9 58.28,24.9 58.54,25.15 58.54,33.53 58.41,33.66 55.87,33.66 55.62,33.92 55.62,35.44 55.87,35.69 60.44,35.69 60.95,35.19 60.95,24.01 59.55,22.61 53.71,22.61 52.57,23.76 52.57,26.68
$1N2976 on Top Layer: 53.42,42.68 55.23,42.68 55.49,42.42 55.49,41.66 56.25,40.9 58.92,40.9 59.55,41.54 59.55,49.92 59.17,50.3 57.14,50.3 56.76,50.68 56.76,52.2 61.08,52.2 61.58,51.7 61.58,40.77 60.06,39.25 54.3,39.25 53.42,40.13
$1N2981 on Top Layer: 51.52,58.81 53.33,58.81 53.71,58.43 53.71,57.66 57.27,57.66 57.65,58.05 57.65,66.3 57.27,66.68 55.36,66.68 55.11,66.94 55.11,68.59 55.36,68.84 59.17,68.84 59.68,68.33 59.68,56.27 58.92,55.51 52.06,55.51 51.3,56.27 51.3,58.58
$1N4284 on Top Layer: 44.9,15.88 51.17,15.88 51.55,15.5 52.69,15.5 52.82,15.37 52.82,14.61 52.55,14.33 49.37,14.33 49.14,14.1 45.24,14.1 44.9,14.45
$1N4449 on Top Layer: 54.85,14.48 55.87,15.5 56.63,15.5 56.61,15.48 56.61,14.76 56.15,14.76 55.62,14.23 55.11,14.23
$1N4449 on Top Layer: 55.68,14.66 55.99,14.97 55.99,16.38 56.25,16.64 57.77,16.64 58.03,16.39 58.03,14.61 57.9,14.48 56.25,14.48 56,14.23 56,13.6 55.87,13.47 53.84,13.47 53.58,13.72 53.58,14.66
$1N4597 on Top Layer: 45.28,33.03 51.03,33.03 52.04,32.01 52.04,30.74 51.61,30.31 45.86,30.31 45.28,30.89
$1N4599 on Top Layer: 53.91,31.06 55.98,33.14 57.92,33.14 58.03,33.03 58.03,31.64 56.18,31.64 54.26,29.72 52.61,29.72 52.61,31.06
$1N4723 on Top Layer: 45.79,49.69 49.75,49.69 50.15,49.28 50.15,48.65 50.53,48.27 52.69,48.27 52.95,48.01 52.95,47.25 52.69,47 45.71,47 45.33,47.38 45.33,49.23
$1N4725 on Top Layer: 57.27,43.06 58.92,43.06 59.17,42.81 59.17,41.41 58.92,41.15 56.38,41.15 55.62,41.92 55.62,45.22 55.11,45.73 53.91,45.73 53.5,46.13 53.5,47.04 53.71,47.25 56.38,47.25 56.76,46.87 56.76,43.57
$1N4849 on Top Layer: 44.13,65.46 48.05,65.46 49.11,64.4 50.47,64.4 50.79,64.08 50.79,63.38 50.53,63.13 44.31,63.13 44.06,63.38 44.06,64.9 44.19,65.03 44.19,65.41
$1N4851 on Top Layer: 51.55,63.38 53.2,63.38 53.33,63.51 53.33,66.05 53.71,66.43 57.14,66.43 57.39,66.17 57.39,65.03 57.14,64.78 54.84,64.78 54.59,64.52 54.59,62.48 54.34,62.24 51.69,62.24 51.47,62.46 51.47,63.3
$1N5986 on Top Layer: 73.27,21.18 73.27,18.89 81.91,18.89 82.16,18.64 82.16,13.84 82.31,13.69 84.45,13.69 84.57,13.81 84.57,20.42 83.81,21.18
$1N6012 on Top Layer: 73.27,37.69 73.27,35.4 81.91,35.4 82.16,35.15 82.16,30.35 82.31,30.2 84.45,30.2 84.57,30.32 84.57,36.93 83.81,37.69
$1N6038 on Top Layer: 73.27,54.16 73.27,52.13 81.9,52.13 82.16,51.88 82.16,47.08 82.31,46.92 84.44,46.92 84.57,47.05 84.57,53.65 84.06,54.16
$1N6064 on Top Layer: 73.27,70.36 73.27,68.59 81.9,68.59 82.16,68.33 82.16,63.53 82.31,63.38 84.44,63.38 84.57,63.51 84.57,70.11 84.32,70.36

## Text on the board
Bottom Silkscreen Layer: H7 | H5 | H3 | H1 | H2 | H8 | H6 | H4 | by:GJJ / 2025.11.28 | 灯灭为充满
